# Altium project Timingcard_PROJECT.PrjPcb (part 3 of 4)

## Sheet 09-USBUart_PPSMUX_UARTMUX.SchDoc
size B; SheetNumber: 9; SheetTotal: 16; SPICEModelCacheLIOYUQKN: <root> / <DocumentId>LIOYUQKN</DocumentId> / <CacheFrame Number="0"> / <Model Name="emk105bj105_v-f" Kind="CKT"> / <Text>* EMK105BJ105_V-F     SPICE MODEL  ( General Type ) / *-------------------------------------------------------------------------------------------------------- / * Model Generated by TAIYO YUDEN Corporation (http://www.ty-top.com) / * Version 1.0 / * TAIYO YUDEN Control No. 170508_130520 / * Copyright(c) 2012 TAIYO YUDEN CO.,LTD. All Rights Reserved. / *-------------------------------------------------------------------------------------------------------- / * / * Products Name : Multilayer Ceramic Capacitors / * / * Characteristics : / *     Capacitance : 1 uF , Rated Voltage : 16V , TCC : X5R / *     Case Size : 1.0 x 0.5 / 0.039 x 0.02 [mm/inch] , Thickness : 0.5 / 0.02 [mm/inch] / *     (Conditions: Temperature = 25 degC , DC Bias Current/Voltage = 0A / 0V) / * / * Frequency Range : 40Hz - 3GHz / * / * External Node Assignments : / * / *  1  o---| |---o  2 / * / *-------------------------------------------------------------------------------------------------------- / .SubCkt EMK105BJ105_V-F 1 2 / **************************** / C0 1 110 0.68309u / Cm 1 101 0.26053u / C1 101 102 0.94076u / Rc1 101 102 1.9029k / C2 102 103 0.66707u / Rc2 102 103 120.36 / C3 103 110 0.57203u / Rc3 103 110 2.1097 / C2m 1 301 0.1871u / C21 301 302 3.2494u / Rc21 301 302 1.1117k / C22 302 303 2.1014u / Rc22 302 303 1.484k / C23 303 304 2.1172u / Rc23 303 304 1.3876k / C24 304 305 0.75729u / Rc24 304 305 332.59 / C25 305 306 0.94401u / Rc25 305 306 249.09 / C26 306 307 0.34674u / Rc26 306 307 28.352 / C27 307 308 0.37158u / Rc27 307 308 19.989 / C28 308 309 0.17933u / Rc28 308 309 31.748 / C29 309 110 0.016445u / Rc29 309 110 1.0592 / Rp0 1 110 100Meg / L0 110 120 0.2216n / Lm 120 130 0.1509n / L1 120 121 0.12659n / RL1 121 130 0.85161 / L2 120 122 0.15996n / RL2 122 130 0.42469 / L3 120 123 7.9543n / RL3 123 130 0.54643m / CR 120 124 0.24334u / LR 124 125 0.090738n / RR 125 130 68.076m / CL 130 140 2.7354p / LL 130 140 0.10762n / RL 130 140 50.614 / Rs 140 2 7.5416m / **************************** / .ends EMK105BJ105_V-F</Text> / </Model> / </CacheFrame> / </root>
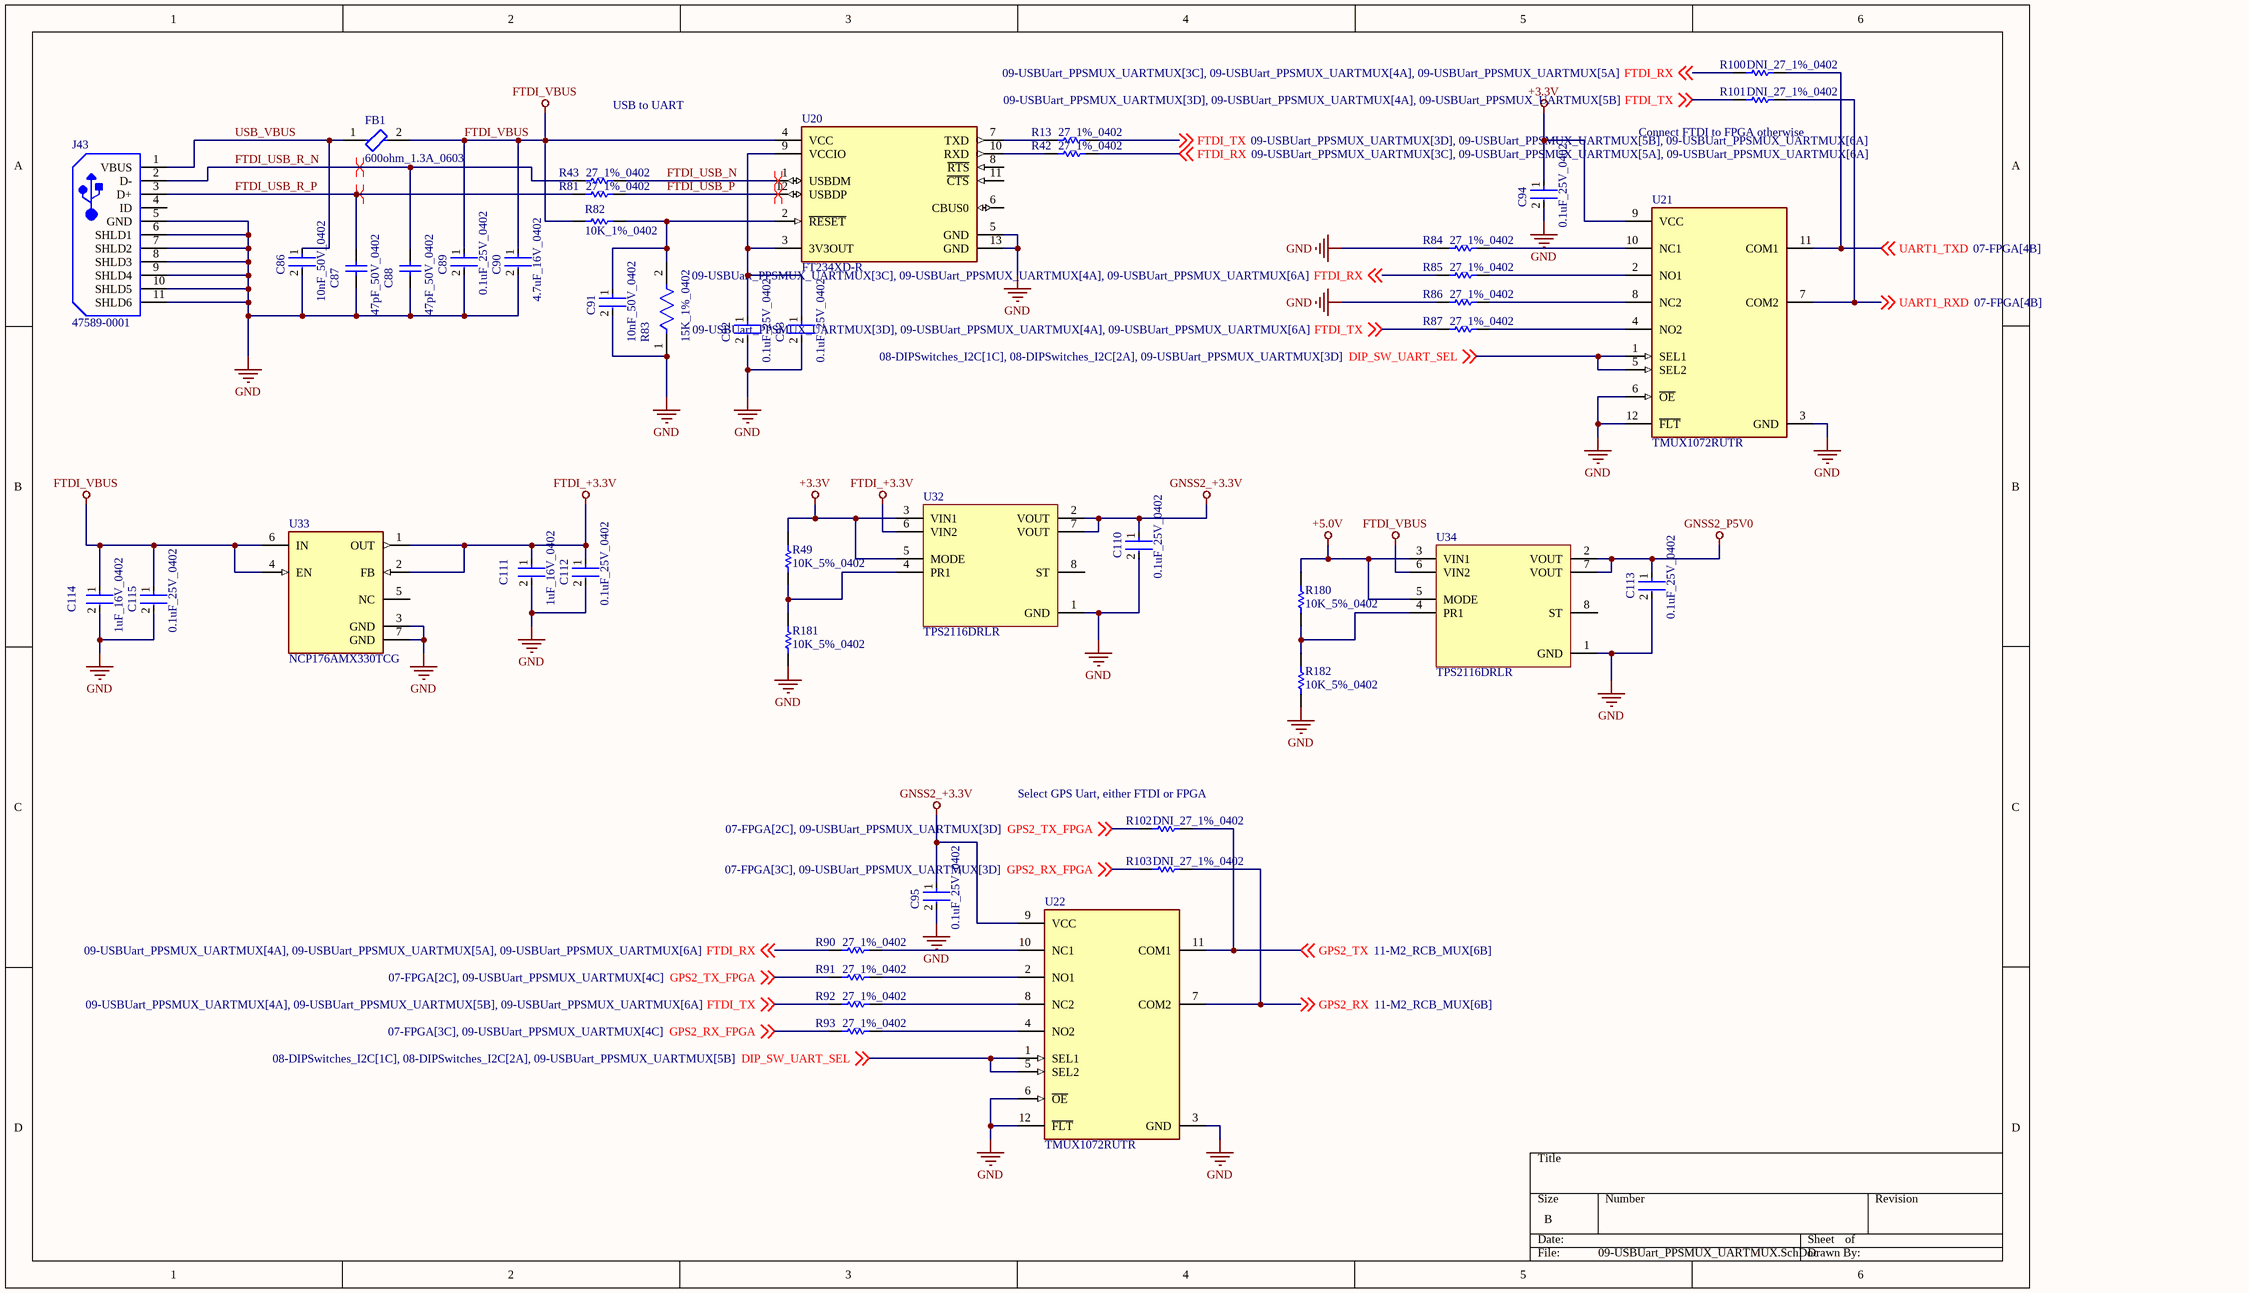
[diagram p9: 09-USBUart_PPSMUX_UARTMUX.SchDoc]

### Parts
C86  10nF_50V_0402  [FP-CC0402-MFG]
C87  47pF_50V_0402  [CAPC1005X55X25LL05T10]
C88  47pF_50V_0402  [CAPC1005X55X25LL05T10]
C89  0.1uF_25V_0402  [FP-0402-L_1_0_1-W_0_5_0_1-IPC_C]
C90  4.7uF_16V_0402  [FP-CL829-IPC_C]
C91  10nF_50V_0402  [FP-CC0402-MFG]
C92  0.1uF_25V_0402  [FP-0402-L_1_0_1-W_0_5_0_1-IPC_C]
C93  0.1uF_25V_0402  [FP-0402-L_1_0_1-W_0_5_0_1-IPC_C]
C94  0.1uF_25V_0402  [FP-0402-L_1_0_1-W_0_5_0_1-IPC_C]
C95  0.1uF_25V_0402  [FP-0402-L_1_0_1-W_0_5_0_1-IPC_C]
C110  0.1uF_25V_0402  [FP-0402-L_1_0_1-W_0_5_0_1-IPC_C]
C111  1uF_16V_0402  [FP-0402-L_1_0_0_05-W_0_5-IPC_A]
C112  0.1uF_25V_0402  [FP-0402-L_1_0_1-W_0_5_0_1-IPC_C]
C113  0.1uF_25V_0402  [FP-0402-L_1_0_1-W_0_5_0_1-IPC_C]
C114  1uF_16V_0402  [FP-0402-L_1_0_0_05-W_0_5-IPC_A]
C115  0.1uF_25V_0402  [FP-0402-L_1_0_1-W_0_5_0_1-IPC_C]
FB1  600ohm_1.3A_0603  [FP-BLM18-0_15-t0_8-IPC_A]
J43  47589-0001  [MOLX-47589-0001_V]
R13  27_1%_0402  [RESC1005X40X25NL05T05]
R42  27_1%_0402  [RESC1005X40X25NL05T05]
R43  27_1%_0402  [RESC1005X40X25NL05T05]
R49  10K_5%_0402  [RESC1005X40X25ML05T05]
R81  27_1%_0402  [RESC1005X40X25NL05T05]
R82  10K_1%_0402  [RESC1005X40X25LL05T10]
R83  15K_1%_0402  [FP-ERJ2R-MFG]
R84  27_1%_0402  [RESC1005X40X25NL05T05]
R85  27_1%_0402  [RESC1005X40X25NL05T05]
R86  27_1%_0402  [RESC1005X40X25NL05T05]
R87  27_1%_0402  [RESC1005X40X25NL05T05]
R90  27_1%_0402  [RESC1005X40X25NL05T05]
R91  27_1%_0402  [RESC1005X40X25NL05T05]
R92  27_1%_0402  [RESC1005X40X25NL05T05]
R93  27_1%_0402  [RESC1005X40X25NL05T05]
R100  DNI_27_1%_0402  [RESC1005X40X25NL05T05]  (no BOM)
R101  DNI_27_1%_0402  [RESC1005X40X25NL05T05]  (no BOM)
R102  DNI_27_1%_0402  [RESC1005X40X25NL05T05]  (no BOM)
R103  DNI_27_1%_0402  [RESC1005X40X25NL05T05]  (no BOM)
R180  10K_5%_0402  [RESC1005X40X25ML05T05]
R181  10K_5%_0402  [RESC1005X40X25ML05T05]
R182  10K_5%_0402  [RESC1005X40X25ML05T05]
U20  FT234XD-R  [FP-DFN-12-IPC_B]
U21  TMUX1072RUTR  [FP-RUT0012A-MFG]
U22  TMUX1072RUTR  [FP-RUT0012A-MFG]
U32  TPS2116DRLR  [IC_TPS2116]
U33  NCP176AMX330TCG  [FP-711AT-MFG]
U34  TPS2116DRLR  [IC_TPS2116]

### Nets
+3.3V: C94.1 R49.2 U21.9(VCC) U32.3(VIN1) U32.5(MODE)
+5.0V: R180.2 U34.3(VIN1) U34.5(MODE)
FTDI_+3.3V: C111.1 C112.1 U32.6(VIN2) U33.1(OUT) U33.2(FB)
FTDI_VBUS: C89.1 C90.1 C114.1 C115.1 FB1.2 R82.2 U20.4(VCC) U33.4(EN) U33.6(IN) U34.6(VIN2)
GND: C86.2 C87.1 C88.1 C89.2 C90.2 C91.2 C92.2 C93.2 C94.2 C95.2 C110.2 C111.2 C112.2 C113.2 C114.2 C115.2 J43.5(GND) J43.6(SHLD1) J43.7(SHLD2) J43.8(SHLD3) J43.9(SHLD4) J43.10(SHLD5) J43.11(SHLD6) R83.1 R84.1 R86.1 R181.1 R182.1 U20.5(GND) U20.13(GND) U21.3(GND) U21.6(~{OE}) U21.12(~{FLT}) U22.3(GND) U22.6(~{OE}) U22.12(~{FLT}) U32.1(GND) U33.3(GND) U33.7(GND) U34.1(GND)
GNSS2_+3.3V: C95.1 C110.1 U22.9(VCC) U32.2(VOUT) U32.7(VOUT)
GNSS2_P5V0: C113.1 U34.2(VOUT) U34.7(VOUT)
DIP_SW_UART_SEL: U21.1(SEL1) U21.5(SEL2) U22.1(SEL1) U22.5(SEL2) ; off-sheet DIP_SW_UART_SEL
FTDI_RX: R42.2 R85.1 R90.1 R100.1 ; off-sheet FTDI_RX
FTDI_TX: R13.2 R87.1 R92.1 R101.1 ; off-sheet FTDI_TX
FTDI_USB_N: R43.2 U20.1(USBDM)
FTDI_USB_P: R81.2 U20.12(USBDP)
FTDI_USB_R_N: C88.2 J43.2(D-) R43.1
FTDI_USB_R_P: C87.2 J43.3(D+) R81.1
GPS2_RX: R103.2 U22.7(COM2) ; off-sheet GPS2_RX
GPS2_RX_FPGA: R93.1 R103.1 ; off-sheet GPS2_RX_FPGA
GPS2_TX: R102.2 U22.11(COM1) ; off-sheet GPS2_TX
GPS2_TX_FPGA: R91.1 R102.1 ; off-sheet GPS2_TX_FPGA
UART1_RXD: R101.2 U21.7(COM2) ; off-sheet UART1_RXD
UART1_TXD: R100.2 U21.11(COM1) ; off-sheet UART1_TXD
USB_VBUS: C86.1 FB1.1 J43.1(VBUS)
NetC91_1: C91.1 R82.1 R83.2 U20.2(~{RESET})
NetC92_1: C92.1 C93.1 U20.3(3V3OUT) U20.9(VCCIO)
NetR13_1: R13.1 U20.7(TXD)
NetR42_1: R42.1 U20.10(RXD)
NetR49_1: R49.1 R181.2 U32.4(PR1)
NetR84_2: R84.2 U21.10(NC1)
NetR85_2: R85.2 U21.2(NO1)
NetR86_2: R86.2 U21.8(NC2)
NetR87_2: R87.2 U21.4(NO2)
NetR90_2: R90.2 U22.10(NC1)
NetR91_2: R91.2 U22.2(NO1)
NetR92_2: R92.2 U22.8(NC2)
NetR93_2: R93.2 U22.4(NO2)
NetR180_1: R180.1 R182.2 U34.4(PR1)

Not connected (* = marked no-connect by the designer): J43 4(ID); U20 6(CBUS0) 8(~{RTS}) 11(~{CTS}); U32 8(ST); U33 5(NC); U34 8(ST)

### Layout directives
differential pair: FTDI_USB_N, FTDI_USB_P, FTDI_USB_R_N, FTDI_USB_R_P

### Notes on the sheet
- USB to UART
- (near R101) Connect FTDI to FPGA otherwise
- (near R102) Select GPS Uart, either FTDI or FPGA

### Library data of the parts
C86 C91 = CMP-2100-03592-2: CAP CER 10000PF 50V X7R 0402; Manufacturer Part Number: CC0402KRX7R9BB103; Manufacturer: YAGEO; Temperature Coefficient: 30ppm/°C; Capacitance: 10 nF; Material: Ceramic; Automotive Grade: NA; Tolerance: 0.1; Value: 10 nF; Device Class L3: Ceramic Capacitors; Temperature: -55°C to +125°C; Footprint Url: http://www.yageo.com/exep/pages/download/literatures/UPY-C_GEN_24.pdf; Ipc Land Pattern Name: CAPC10050X50; Device Class L1: Passive Components; Automotive: No; Octopart: https://octopart.com/cc0402krx7r9bb103-yageo-8376513; Lead Free: Yes; Temperature Range Low: -55°C; Height: 0.55mm; ComponentLink2URL: http://www.yageo.com/documents/recent/UPY-GP_NP0_16V-to-50V_16.pdf; Category: Cap; ComponentLink2Description: Datasheet; Temperature Range High: +125°C; Digikey Description: CAP CER 10000PF 50V X7R 0402; Voltage Rating: 50 V; Package: CC0402; Device Class L2: Capacitors; Mouser Description: 0402 10 nF 50 V ±10 % Tolerance X7R SMT Multilayer Ceramic Capacitor; RoHS: TRUE; Temperature Characteristic: X7R
C87 C88 = CMP-2008-04368-1: Part Number: GRM1555C1H470JA01D; Manufacturer: Murata
C89 C92-C95 C110 C112 C113 C115 = CMP-2008-02519-2: General Purpose Ceramic Capacitor, 0402, 100nF, 10%, X7R, 15%, 25V; Package Quantity: 1; Capacitance: 100nF; Min Operating Temperature: -55°C; Voltage: 25V; Voltage Rating: 25V; Construction: Flat; Max Operating Temperature: 125°C; Radiation Hardening: No; Depth: 0.5mm; Thickness: 0.022inch; Voltage Rating (DC): 25V; Number of Pins: 2; Lead Free: Lead Free; Series: -; REACH SVHC: No SVHC; Length: 1mm; Dielectric: X7R; RoHS Compliant: Yes; Mount: Surface Mount; Packaging: Tape and Reel; Case/Package: 0402; Case Code (Imperial): 0402; Termination: SMD/SMT; Width: 0.02inch; Case Code (Metric): 1005; Tolerance: 10%
C90 = CMP-13271-001468-1: Cap Ceramic 4.7uF 16V X5R ±20% SMD 0402 +85°C Paper T/R; Mount: Surface Mount; Case Code (Metric): 1005; Case/Package: 0402; Length: 0.039inch; Capacitance: 4.7uF; Voltage Rating: 16V; Max Operating Temperature: 85°C; Tolerance: 20%; Thickness: 0.022inch; Min Operating Temperature: -55°C; Case Code (Imperial): 0402; Packaging: Tape and Reel; Width: 0.02inch
C111 C114 = CMP-14477-000104-2: None; Tolerance: 10%; Voltage Rating: 16V; Dielectric: X5R; Capacitance: 1uF; Packaging: Tape and Reel; Depth: 0.5mm; Mount: Surface Mount; Thickness: 0.022inch; Package Quantity: 1; Min Operating Temperature: -55°C; Series: M; Voltage Rating (DC): 16V; Termination: SMD/SMT; Case/Package: 0402; Number of Pins: 2; Case Code (Imperial): 0402; Length: 1mm; Halogen Free: Halogen Free; Case Code (Metric): 1005; Width: 0.02inch; RoHS Compliant: Yes; Radiation Hardening: No; Max Operating Temperature: 85°C; Height: 0.5mm; Construction: Flat
FB1 = CMP-0686-00581-3: Chip Ferrite Bead, 0603, 600Ω @ 100MHz, 0.15Ω, 25%, 1.3A; Material: Steel; Number of Lines: 1; Impedance: 600R; DC Resistance (DCR): 150mR; Tolerance: 25%; Case Code (Metric): 1608; Width: 0.8mm; DC Current: 1.3A; Max DC Current: 1.3A; Package Quantity: 1; Number of Pins: 2; Military Standard: Not; RoHS Compliant: Yes; Termination: SMD/SMT; Max Operating Temperature: 125°C; Length: 1.6mm; Depth: 0.8mm; Case Code (Imperial): 0603; Series: BLM18K; Inductor Type: FERRITE BEAD; Core Material: Ferrite; Number of Circuits: 1; Height: 0.8mm; Case/Package: 0603; REACH SVHC: No SVHC; Packaging: Tape and Reel; Min Operating Temperature: -55°C; Max Current Rating: 1.3A; Radiation Hardening: No; Current Rating: 1.3A; Lead Free: Lead Free; Test Frequency: 100MHz; Weight: 7.1E-05oz
J43 = CMP-2000-05610-1: Right Angle Female Type AB Micro USB Connector, 30 V, 1.8 A, -30 to 85 degC, RoHS, Tape and Reel; Number of Ports: 1Port; Current Rating: 1.8A; Brand: Molex; Connector Type: MicroUSBTypeABreceptacle; Number of Contacts: 5Contact; Voltage Rating: 30VAC; Color: Black; Product: MicroUSBTypeABConnectors; Package URL: http://www.molex.com/pdm_docs/sd/475890001_sd.pdf; Contact Plating: Gold; Datasheet URL: http://www.molex.com/webdocs/datasheets/pdf/en-us/0475890001_IO_CONNECTORS.pdf; Operating Temperature Range: -20Cto+85C; Termination Style: SMD/SMT; Mounting Angle: Right; Package Reference: 47589-0001; Gender: Female; Package Description: Micro USB Connector, Pitch 0.65 mm, 5 Positions, Body 7.5 x 5.6 mm; Mounting Technology: SurfaceMount; Contact Material: CopperAlloy; Packaging: Reel; RoHS: True; Standard: USB; Manufacturer URL: http://www.molex.com/; Manufacturer: Molex; Datasheet Version: 12/2016; Product Category: USBConnectors; Series: 47589
R13 R42 R43 R81 R84-R87 R90-R93 R100-R103 = CMP-2002-08434-1: Part Number: CRCW040227R0FKED; Manufacturer: Vishay Dale
R49 R180-R182 = CMP-2002-00433-1: Part Number: ERJ-2GEJ103X; Manufacturer: Panasonic
R82 = CMP-2002-07353-1: Part Number: RC0402FR-0710KL; Manufacturer: Yageo / Phycomp
R83 = CMP-2002-00694-4: RES SMD 15K OHM 1% 1/10W 0402; Manufacturer Part Number: ERJ-2RKF1502X; Manufacturer: Panasonic; Automotive Grade: Grade 0; Voltage Rating: 50V; Resistance: 15kΩ; Temperature Coefficient: 100ppm/°C; Power Rating: 0.1W; Value: 15kΩ; ComponentLink2URL: https://industrial.panasonic.com/cdbs/www-data/pdf/RDA0000/AOA0000C304.pdf; Automotive: Yes; Temperature: -55°C to +155°C; Height: 0.4mm; Digikey Description: RES SMD 15K OHM 1% 1/10W 0402; Category: Res; Device Class L2: Resistors; Device Class L1: Passive Components; Package: ERJ2R; Temperature Range Low: -55°C; Tolerance: 1%; Series: ERJ; Footprint Url: https://b2b-api.panasonic.eu/file_stream/pids/fileversion/1180; Mouser Description: Res Thick Film 1.0 x 0.5 mm 15K Ohm 1% 0.1W(1/10W) 100ppm/ C Molded SMD Punched Carrier T/R; Composition: Thick Film; Lead Free: Yes; Device Class L3: Chip SMD Resistors; Octopart: https://octopart.com/erj-2rkf1502x-panasonic-55404985; RoHS: TRUE; Temperature Range High: +155°C; ComponentLink2Description: Datasheet
U20 = CMP-0248-00027-3: IC USB SERIAL BASIC UART 12DFN; Min Supply Voltage: 2.97V; Number of Ports: 1; Operating Supply Voltage: 5V; Operating Supply Current: 8mA; Max Supply Voltage: 5.5V; Data Rate: 3Mbps; Length: 3mm; Case/Package: DFN; Mount: Surface Mount; Packaging: Tape and Reel; Max Operating Temperature: 85°C; Height: 0.75mm; Number of Pins: 12; Number of Transceivers: 1; Package Quantity: 5000; Min Operating Temperature: -40°C; Width: 3mm; REACH SVHC: No SVHC; Interface: UART; Lead Free: Lead Free
U21 U22 = CMP-04892-000114-1: IC SWITCH SPDT DUAL 12UQFN; Number of Circuits: 2; -3db Bandwidth: 1.2GHz; On-State Resistance: 18R; Number of Pins: 12; Min Operating Temperature: -40°C; RoHS Compliant: Yes; Max Operating Temperature: 125°C; Number of Channels: 2; Packaging: Tape and Reel
U32 U34 = IC_TPS2116DRLR: 1.6-V to 5.5-V, 40-mΩ, 2.5-A, low-IQ, priority power multiplexer 8-SOT-5X3 -40 to 125; MF: Texas Instruments; Check_prices: https://www.snapeda.com/parts/TPS2116DRLR/Texas%20Instruments/view-part/5674360/?ref=eda; MP: TPS2116DRLR; Package: Package; Price: None; Availability: No availability data; SnapEDA_Link: https://www.snapeda.com/parts/TPS2116DRLR/Texas%20Instruments/view-part/5674360/?ref=snap; Value: *; Supplier 1: LCSC; Manufacturer: Texas Instruments; Manufacturer Part Number: TPS2116DRLR; RoHS: Yes; Category: Voltage Supervisors; Stock 1: 562; Pricing 1: 1=0.6651, 10=0.5457, 30=0.4853, 100=0.4264, 500=0.3914, 1000=0.3723 (USD); Supplier Part Number 1: C3235557
U33 = CMP-07128-000022-1: IC REG LINEAR 3.3V 500MA 6XDFN; Manufacturer: ON Semiconductor; Output Type: Fixed; Dropout Voltage: 295mV; Number Of Outputs: 1; Standoff Height: 0mm; Min Supply Voltage: 1.4V; Nominal Supply Current: 60uA; Max Supply Voltage: 5.5V; Max Junction Temp: +150°C; Accuracy Percentage: 0.8%; Footprint Url: https://www.onsemi.com/pub/Collateral/711AT.PDF; Device Class L2: Power Management ICs; Device Class L1: Integrated Circuits (ICs); Digikey Description: IC REG LINEAR 3.3V 500MA 6XDFN; ComponentLink2Description: Datasheet; Output Voltage: 3.3V; ComponentLink2URL: https://www.onsemi.com/pub/Collateral/NCP176-D.PDF; RoHS: TRUE; Lead Free: Yes; Output Current: 500mA; Automotive: No; Temperature Range High: +150°C; Height: 0.45mm; Package: 711AT; Device Class L3: Voltage Regulators - Linear; Octopart: https://octopart.com/ncp176amx330tcg-on+semiconductor-61522616; Category: IC; Manufacturer Part Number: NCP176AMX330TCG; Ipc Land Pattern Name: DFN120X120X37-6; Temperature: to +150°C

## Sheet 11-M2_RCB_MUX.SchDoc
size B; SheetNumber: 11; SheetTotal: 16
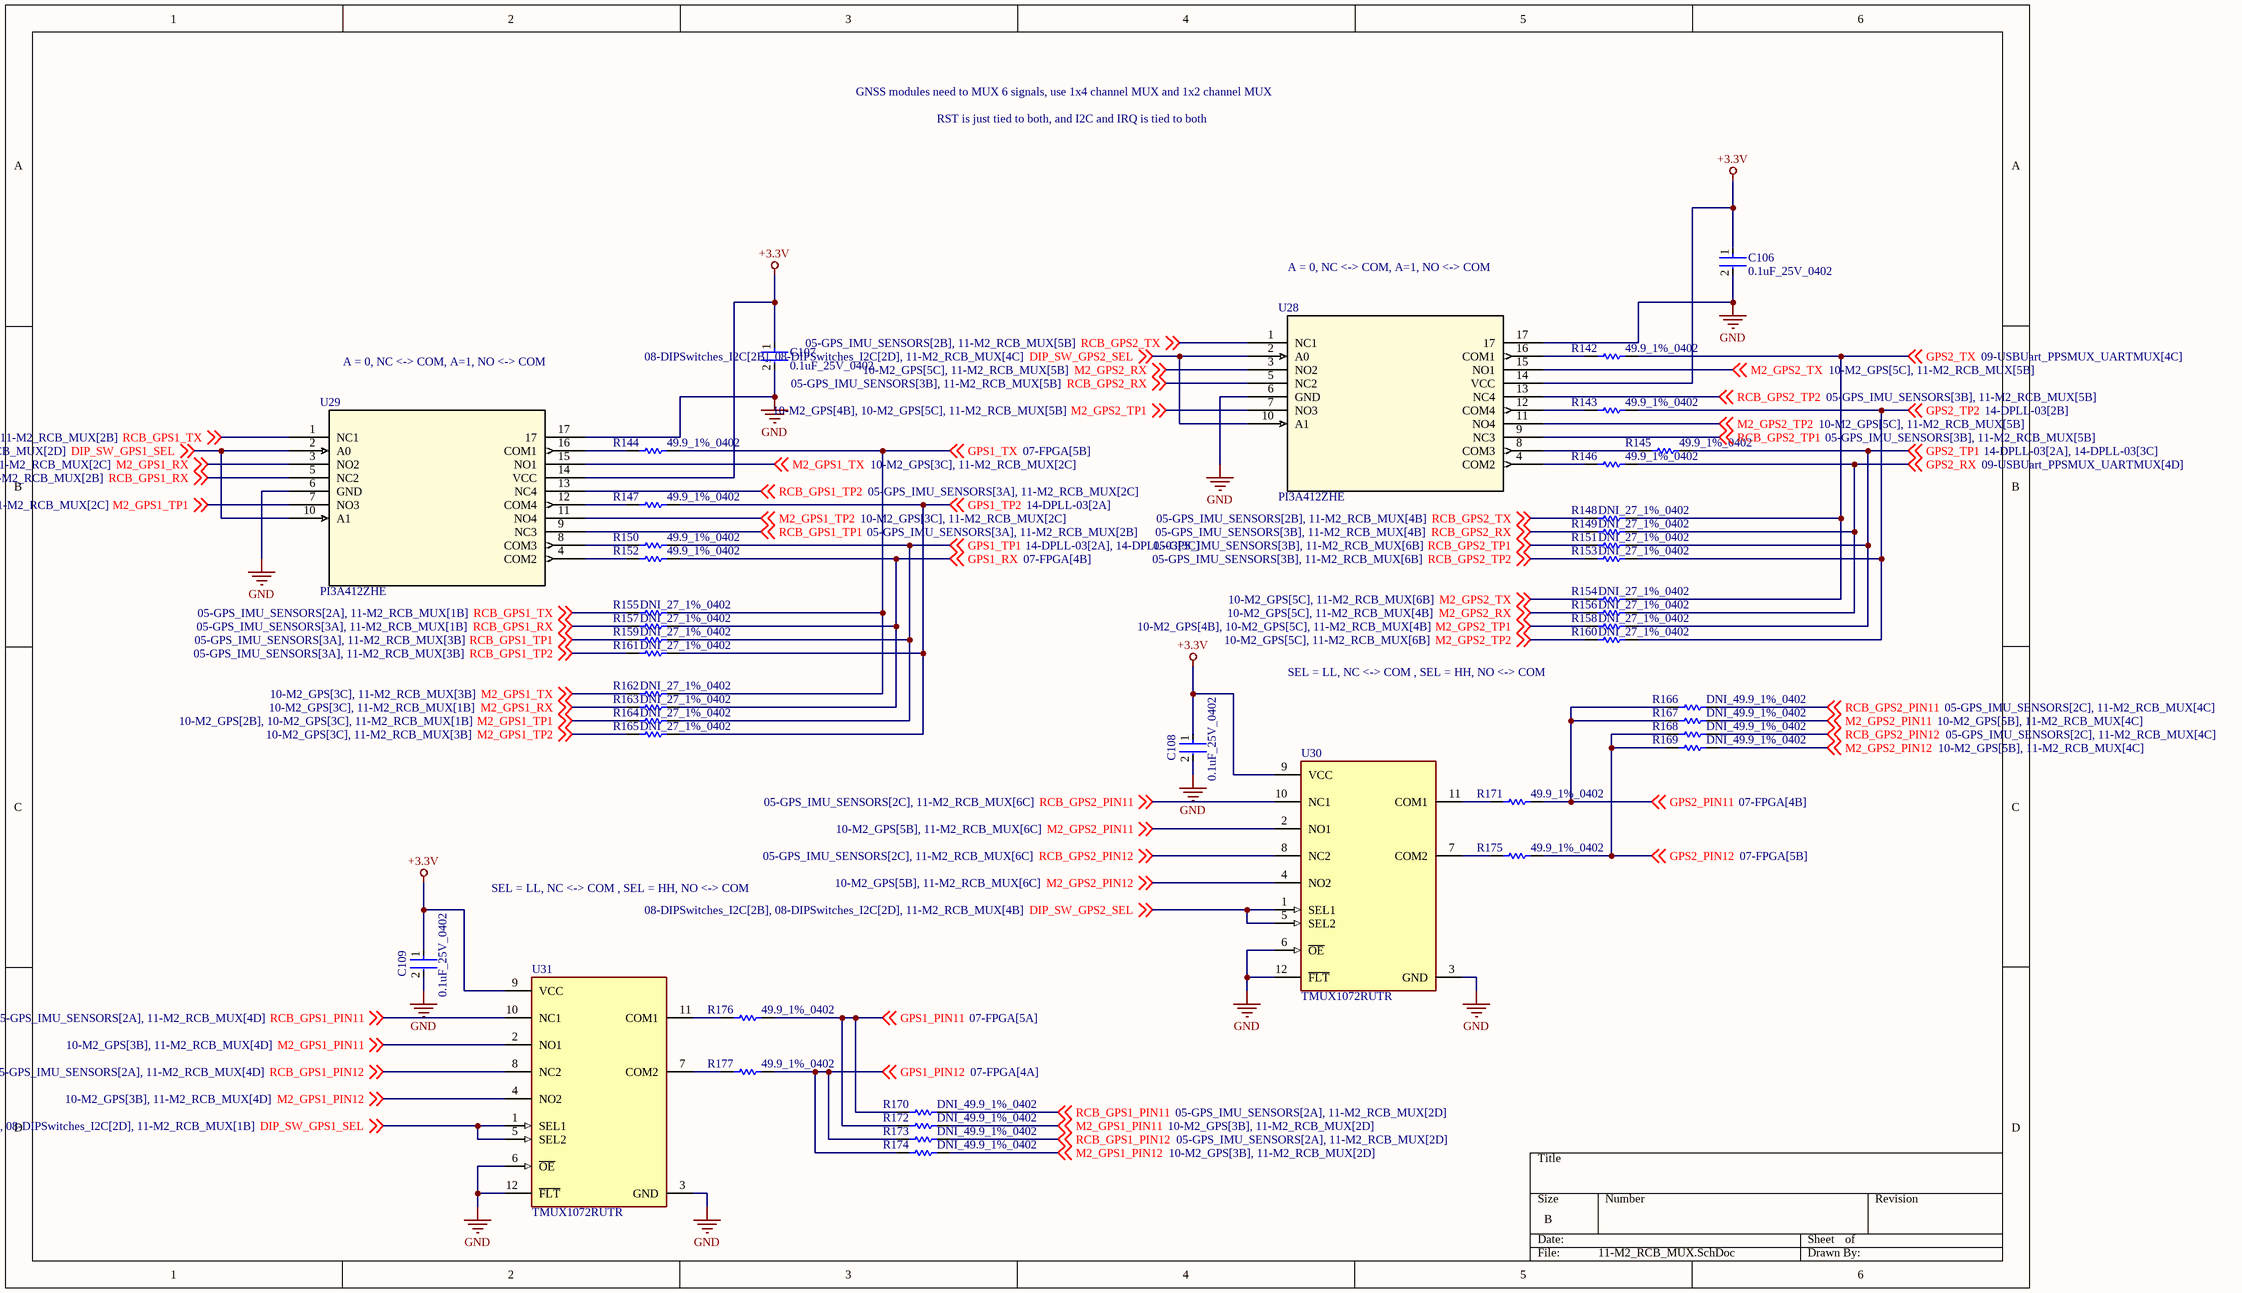
[diagram p10: 11-M2_RCB_MUX.SchDoc]

### Parts
C106  0.1uF_25V_0402  [FP-0402-L_1_0_1-W_0_5_0_1-IPC_C]
C107  0.1uF_25V_0402  [FP-0402-L_1_0_1-W_0_5_0_1-IPC_C]
C108  0.1uF_25V_0402  [FP-0402-L_1_0_1-W_0_5_0_1-IPC_C]
C109  0.1uF_25V_0402  [FP-0402-L_1_0_1-W_0_5_0_1-IPC_C]
R142  49.9_1%_0402  [RESC1005X40X25LL05T10]
R143  49.9_1%_0402  [RESC1005X40X25LL05T10]
R144  49.9_1%_0402  [RESC1005X40X25LL05T10]
R145  49.9_1%_0402  [RESC1005X40X25LL05T10]
R146  49.9_1%_0402  [RESC1005X40X25LL05T10]
R147  49.9_1%_0402  [RESC1005X40X25LL05T10]
R148  DNI_27_1%_0402  [RESC1005X40X25NL05T05]  (no BOM)
R149  DNI_27_1%_0402  [RESC1005X40X25NL05T05]  (no BOM)
R150  49.9_1%_0402  [RESC1005X40X25LL05T10]
R151  DNI_27_1%_0402  [RESC1005X40X25NL05T05]  (no BOM)
R152  49.9_1%_0402  [RESC1005X40X25LL05T10]
R153  DNI_27_1%_0402  [RESC1005X40X25NL05T05]  (no BOM)
R154  DNI_27_1%_0402  [RESC1005X40X25NL05T05]  (no BOM)
R155  DNI_27_1%_0402  [RESC1005X40X25NL05T05]  (no BOM)
R156  DNI_27_1%_0402  [RESC1005X40X25NL05T05]  (no BOM)
R157  DNI_27_1%_0402  [RESC1005X40X25NL05T05]  (no BOM)
R158  DNI_27_1%_0402  [RESC1005X40X25NL05T05]  (no BOM)
R159  DNI_27_1%_0402  [RESC1005X40X25NL05T05]  (no BOM)
R160  DNI_27_1%_0402  [RESC1005X40X25NL05T05]  (no BOM)
R161  DNI_27_1%_0402  [RESC1005X40X25NL05T05]  (no BOM)
R162  DNI_27_1%_0402  [RESC1005X40X25NL05T05]  (no BOM)
R163  DNI_27_1%_0402  [RESC1005X40X25NL05T05]  (no BOM)
R164  DNI_27_1%_0402  [RESC1005X40X25NL05T05]  (no BOM)
R165  DNI_27_1%_0402  [RESC1005X40X25NL05T05]  (no BOM)
R166  DNI_49.9_1%_0402  [RESC1005X40X25LL05T10]  (no BOM)
R167  DNI_49.9_1%_0402  [RESC1005X40X25LL05T10]  (no BOM)
R168  DNI_49.9_1%_0402  [RESC1005X40X25LL05T10]  (no BOM)
R169  DNI_49.9_1%_0402  [RESC1005X40X25LL05T10]  (no BOM)
R170  DNI_49.9_1%_0402  [RESC1005X40X25LL05T10]  (no BOM)
R171  49.9_1%_0402  [RESC1005X40X25LL05T10]
R172  DNI_49.9_1%_0402  [RESC1005X40X25LL05T10]  (no BOM)
R173  DNI_49.9_1%_0402  [RESC1005X40X25LL05T10]  (no BOM)
R174  DNI_49.9_1%_0402  [RESC1005X40X25LL05T10]  (no BOM)
R175  49.9_1%_0402  [RESC1005X40X25LL05T10]
R176  49.9_1%_0402  [RESC1005X40X25LL05T10]
R177  49.9_1%_0402  [RESC1005X40X25LL05T10]
U28  PI3A412ZHE  [ZH16_PER]
U29  PI3A412ZHE  [ZH16_PER]
U30  TMUX1072RUTR  [FP-RUT0012A-MFG]
U31  TMUX1072RUTR  [FP-RUT0012A-MFG]

### Nets
+3.3V: C106.1 C107.1 C108.1 C109.1 U28.14(VCC) U29.14(VCC) U30.9(VCC) U31.9(VCC)
GND: C106.2 C107.2 C108.2 C109.2 U28.6(GND) U28.17 U29.6(GND) U29.17 U30.3(GND) U30.6(~{OE}) U30.12(~{FLT}) U31.3(GND) U31.6(~{OE}) U31.12(~{FLT})
DIP_SW_GPS1_SEL: U29.2(A0) U29.10(A1) U31.1(SEL1) U31.5(SEL2) ; off-sheet DIP_SW_GPS1_SEL
DIP_SW_GPS2_SEL: U28.2(A0) U28.10(A1) U30.1(SEL1) U30.5(SEL2) ; off-sheet DIP_SW_GPS2_SEL
GPS1_PIN11: R170.1 R172.1 R176.2 ; off-sheet GPS1_PIN11
GPS1_PIN12: R173.1 R174.1 R177.2 ; off-sheet GPS1_PIN12
GPS1_RX: R152.2 R157.2 R163.2 ; off-sheet GPS1_RX
GPS1_TP1: R150.2 R159.2 R164.2 ; off-sheet GPS1_TP1
GPS1_TP2: R147.2 R161.2 R165.2 ; off-sheet GPS1_TP2
GPS1_TX: R144.2 R155.2 R162.2 ; off-sheet GPS1_TX
GPS2_PIN11: R166.1 R167.1 R171.2 ; off-sheet GPS2_PIN11
GPS2_PIN12: R168.1 R169.1 R175.2 ; off-sheet GPS2_PIN12
GPS2_RX: R146.2 R149.2 R156.2 ; off-sheet GPS2_RX
GPS2_TP1: R145.2 R151.2 R158.2 ; off-sheet GPS2_TP1
GPS2_TP2: R143.2 R153.2 R160.2 ; off-sheet GPS2_TP2
GPS2_TX: R142.2 R148.2 R154.2 ; off-sheet GPS2_TX
M2_GPS1_PIN11: R172.2 U31.2(NO1) ; off-sheet M2_GPS1_PIN11
M2_GPS1_PIN12: R174.2 U31.4(NO2) ; off-sheet M2_GPS1_PIN12
M2_GPS1_RX: R163.1 U29.3(NO2) ; off-sheet M2_GPS1_RX
M2_GPS1_TP1: R164.1 U29.7(NO3) ; off-sheet M2_GPS1_TP1
M2_GPS1_TP2: R165.1 U29.11(NO4) ; off-sheet M2_GPS1_TP2
M2_GPS1_TX: R162.1 U29.15(NO1) ; off-sheet M2_GPS1_TX
M2_GPS2_PIN11: R167.2 U30.2(NO1) ; off-sheet M2_GPS2_PIN11
M2_GPS2_PIN12: R169.2 U30.4(NO2) ; off-sheet M2_GPS2_PIN12
M2_GPS2_RX: R156.1 U28.3(NO2) ; off-sheet M2_GPS2_RX
M2_GPS2_TP1: R158.1 U28.7(NO3) ; off-sheet M2_GPS2_TP1
M2_GPS2_TP2: R160.1 U28.11(NO4) ; off-sheet M2_GPS2_TP2
M2_GPS2_TX: R154.1 U28.15(NO1) ; off-sheet M2_GPS2_TX
RCB_GPS1_PIN11: R170.2 U31.10(NC1) ; off-sheet RCB_GPS1_PIN11
RCB_GPS1_PIN12: R173.2 U31.8(NC2) ; off-sheet RCB_GPS1_PIN12
RCB_GPS1_RX: R157.1 U29.5(NC2) ; off-sheet RCB_GPS1_RX
RCB_GPS1_TP1: R159.1 U29.9(NC3) ; off-sheet RCB_GPS1_TP1
RCB_GPS1_TP2: R161.1 U29.13(NC4) ; off-sheet RCB_GPS1_TP2
RCB_GPS1_TX: R155.1 U29.1(NC1) ; off-sheet RCB_GPS1_TX
RCB_GPS2_PIN11: R166.2 U30.10(NC1) ; off-sheet RCB_GPS2_PIN11
RCB_GPS2_PIN12: R168.2 U30.8(NC2) ; off-sheet RCB_GPS2_PIN12
RCB_GPS2_RX: R149.1 U28.5(NC2) ; off-sheet RCB_GPS2_RX
RCB_GPS2_TP1: R151.1 U28.9(NC3) ; off-sheet RCB_GPS2_TP1
RCB_GPS2_TP2: R153.1 U28.13(NC4) ; off-sheet RCB_GPS2_TP2
RCB_GPS2_TX: R148.1 U28.1(NC1) ; off-sheet RCB_GPS2_TX
NetR142_1: R142.1 U28.16(COM1)
NetR143_1: R143.1 U28.12(COM4)
NetR144_1: R144.1 U29.16(COM1)
NetR145_1: R145.1 U28.8(COM3)
NetR146_1: R146.1 U28.4(COM2)
NetR147_1: R147.1 U29.12(COM4)
NetR150_1: R150.1 U29.8(COM3)
NetR152_1: R152.1 U29.4(COM2)
NetR171_1: R171.1 U30.11(COM1)
NetR175_1: R175.1 U30.7(COM2)
NetR176_1: R176.1 U31.11(COM1)
NetR177_1: R177.1 U31.7(COM2)

### Notes on the sheet
- GNSS modules need to MUX 6 signals, use 1x4 channel MUX and 1x2 channel MUX
- RST is just tied to both, and I2C and IRQ is tied to both
- A = 0, NC <-> COM, A=1, NO <-> COM
- SEL = LL, NC <-> COM , SEL = HH, NO <-> COM

### Library data of the parts
C106-C109 = CMP-2008-02519-2: as C89 on sheet 09-USBUart_PPSMUX_UARTMUX; Package Quantity: 1; Capacitance: 100nF; Min Operating Temperature: -55°C; Voltage: 25V; Voltage Rating: 25V; Construction: Flat; Max Operating Temperature: 125°C; Radiation Hardening: No; Depth: 0.5mm; Thickness: 0.022inch; Voltage Rating (DC): 25V; Number of Pins: 2; Lead Free: Lead Free; Series: -; REACH SVHC: No SVHC; Length: 1mm; Dielectric: X7R; RoHS Compliant: Yes; Mount: Surface Mount; Packaging: Tape and Reel; Case/Package: 0402; Case Code (Imperial): 0402; Termination: SMD/SMT; Width: 0.02inch; Case Code (Metric): 1005; Tolerance: 10%
R142-R147 R150 R152 R166-R177 = CMP-2002-07709-1: Manufacturer: Yageo / Phycomp; Part Number: RC0402FR-0749R9L
R148 R149 R151 R153-R165 = CMP-2002-08434-1: as R13 on sheet 09-USBUart_PPSMUX_UARTMUX
U28 U29 = PI3A412ZHE: No Description Available; Mfr_Name: Pericom; RefDes: RefDes; Type: Type
U30 U31 = CMP-04892-000114-1: as U21 on sheet 09-USBUart_PPSMUX_UARTMUX; Number of Pins: 12; Min Operating Temperature: -40°C; RoHS Compliant: Yes; Max Operating Temperature: 125°C; Number of Channels: 2; Packaging: Tape and Reel

## Sheet 12-DPLL-01.SchDoc
size B; SheetNumber: 12; SheetTotal: 16
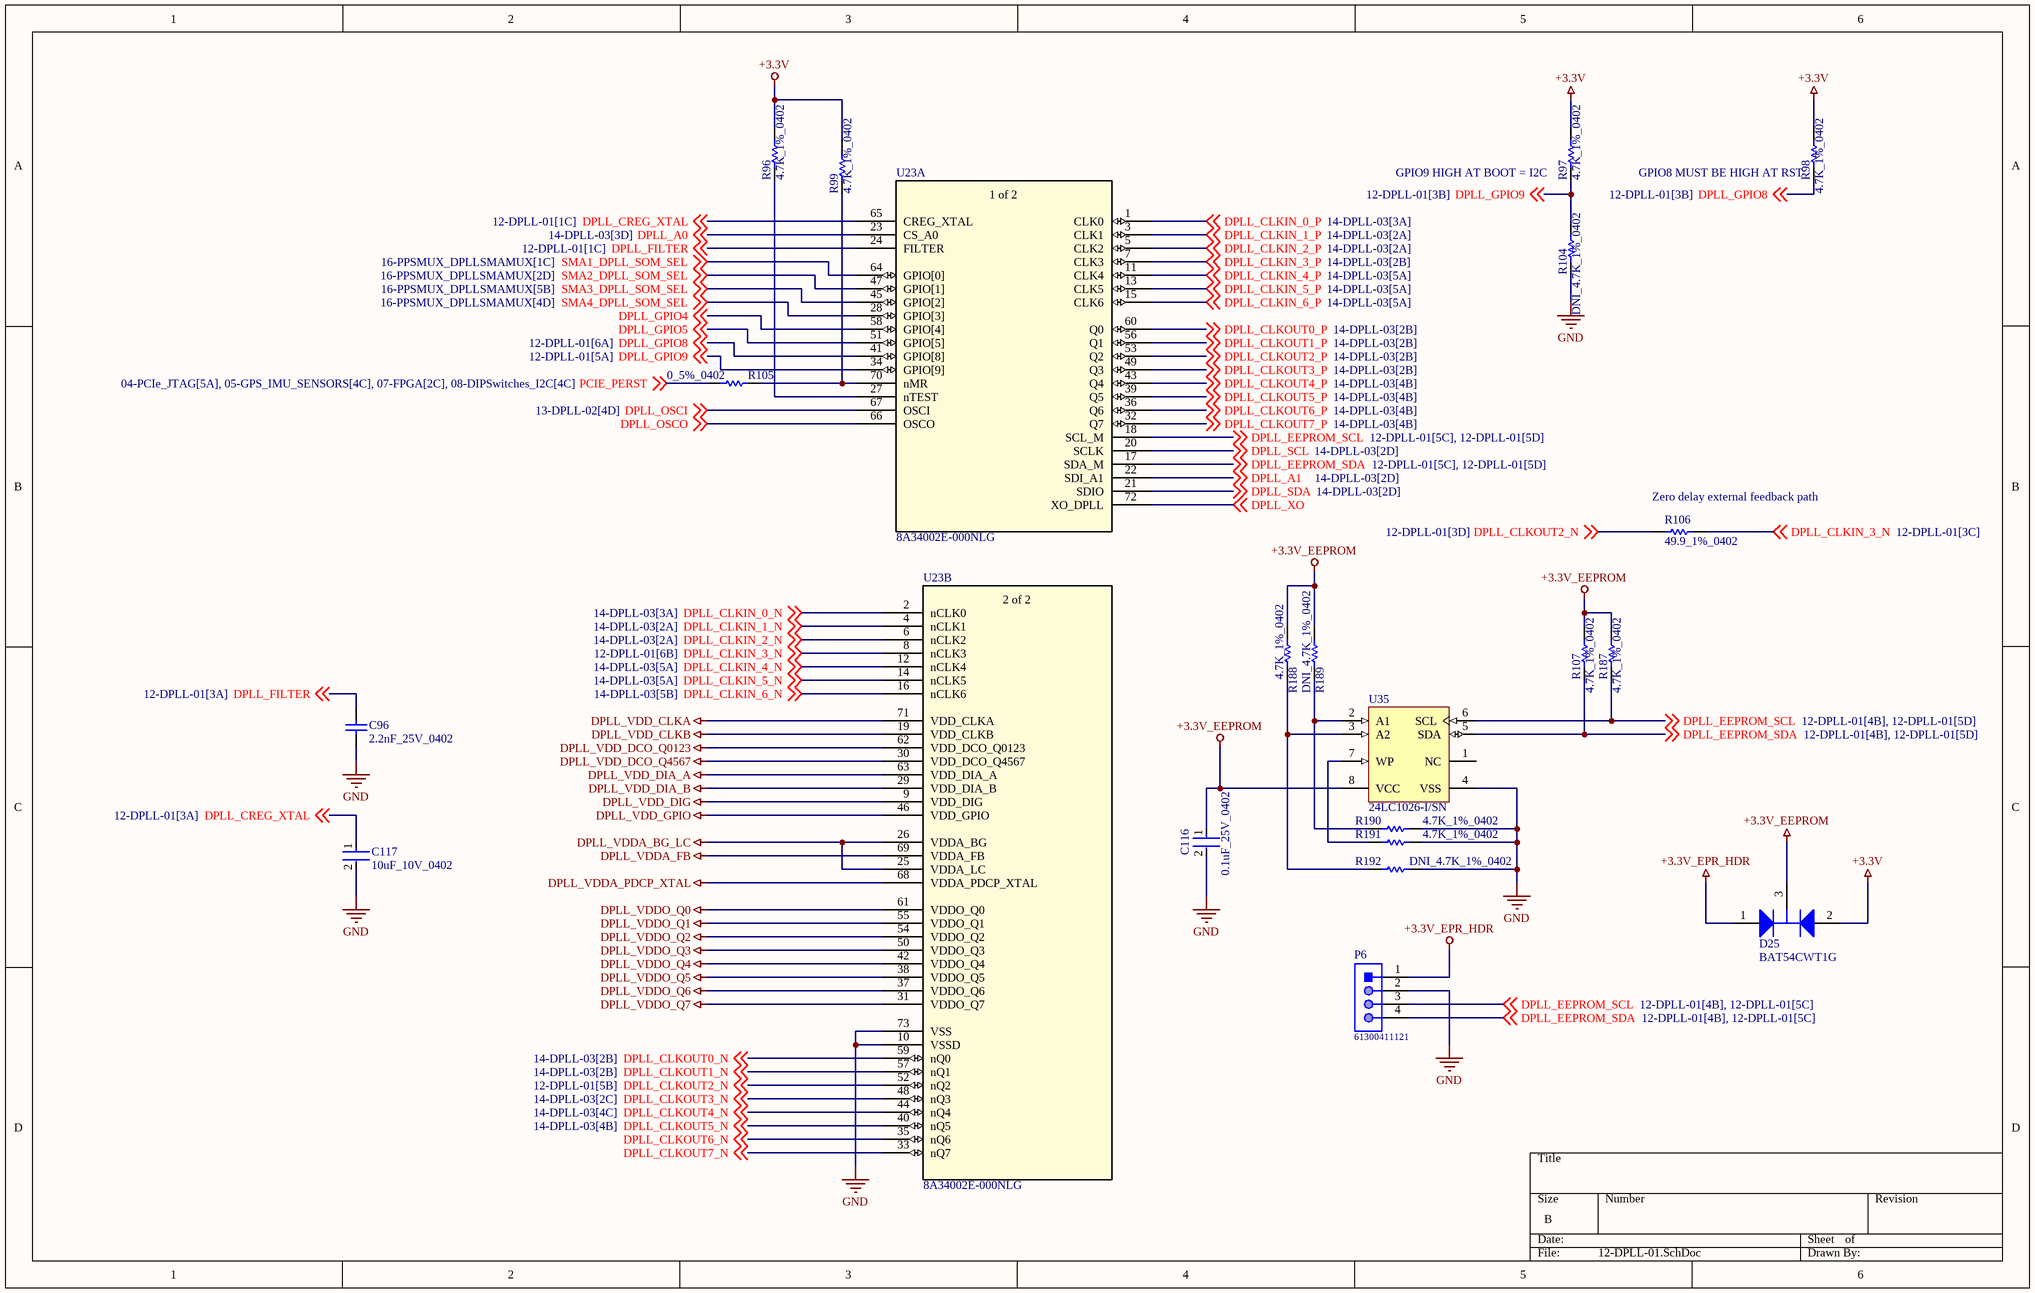
[diagram p11: 12-DPLL-01.SchDoc]

### Parts
C96  2.2nF_25V_0402  [CAPC1005X56X25LL10T15]
C116  0.1uF_25V_0402  [FP-0402-L_1_0_1-W_0_5_0_1-IPC_C]
C117  10uF_10V_0402  [FP-CL05A106MP5NUNC-MFG]
D25  BAT54CWT1G  [ONSC-SOT-323-3-419-04_V]
P6  61300411121  [61300411121]
R96  4.7K_1%_0402  [RESC1005X40X25NL10T10]
R97  4.7K_1%_0402  [RESC1005X40X25NL10T10]
R98  4.7K_1%_0402  [RESC1005X40X25NL10T10]
R99  4.7K_1%_0402  [RESC1005X40X25NL10T10]
R104  DNI_4.7K_1%_0402  [RESC1005X40X25NL10T10]  (no BOM)
R105  0_5%_0402  [RESC1005X40X25LL10T10]
R106  49.9_1%_0402  [RESC1005X40X25NL10T10]
R107  4.7K_1%_0402  [RESC1005X40X25NL10T10]
R187  4.7K_1%_0402  [RESC1005X40X25NL10T10]
R188  4.7K_1%_0402  [RESC1005X40X25NL10T10]
R189  DNI_4.7K_1%_0402  [RESC1005X40X25NL10T10]  (no BOM)
R190  4.7K_1%_0402  [RESC1005X40X25NL10T10]
R191  4.7K_1%_0402  [RESC1005X40X25NL10T10]
R192  DNI_4.7K_1%_0402  [RESC1005X40X25NL10T10]  (no BOM)
U23  8A34002E-000NLG  [QFN_2E-000NLG_REN]  (parts A,B of 2)
U35  24LC1026-I/SN  [MCHP-SOIC-SN8_N]

### Nets
+3.3V: D25.2(A2) R96.2 R97.1 R98.1 R99.2
+3.3V_EEPROM: C116.1 D25.3(K) R107.1 R187.1 R188.2 R189.2 U35.8(VCC)
+3.3V_EPR_HDR: D25.1(A1) P6.1
DPLL_VDD_CLKA: U23.71(VDD_CLKA)
DPLL_VDD_CLKB: U23.19(VDD_CLKB)
DPLL_VDD_DCO_Q0123: U23.62(VDD_DCO_Q0123)
DPLL_VDD_DCO_Q4567: U23.30(VDD_DCO_Q4567)
DPLL_VDD_DIA_A: U23.63(VDD_DIA_A)
DPLL_VDD_DIA_B: U23.29(VDD_DIA_B)
DPLL_VDD_DIG: U23.9(VDD_DIG)
DPLL_VDD_GPIO: U23.46(VDD_GPIO)
DPLL_VDDA_BG_LC: U23.25(VDDA_LC) U23.26(VDDA_BG)
DPLL_VDDA_FB: U23.69(VDDA_FB)
DPLL_VDDA_PDCP_XTAL: U23.68(VDDA_PDCP_XTAL)
DPLL_VDDO_Q0: U23.61(VDDO_Q0)
DPLL_VDDO_Q1: U23.55(VDDO_Q1)
DPLL_VDDO_Q2: U23.54(VDDO_Q2)
DPLL_VDDO_Q3: U23.50(VDDO_Q3)
DPLL_VDDO_Q4: U23.42(VDDO_Q4)
DPLL_VDDO_Q5: U23.38(VDDO_Q5)
DPLL_VDDO_Q6: U23.37(VDDO_Q6)
DPLL_VDDO_Q7: U23.31(VDDO_Q7)
GND: C96.1 C116.2 C117.2 P6.2 R104.2 R190.1 R191.1 R192.2 U23.10(VSSD) U23.73(VSS) U35.4(VSS)
DPLL_A0: U23.23(CS_A0) ; off-sheet DPLL_A0
DPLL_A1: U23.22(SDI_A1) ; off-sheet DPLL_A1
DPLL_CLKIN_0_N: U23.2(nCLK0) ; off-sheet DPLL_CLKIN_0_N
DPLL_CLKIN_0_P: U23.1(CLK0) ; off-sheet DPLL_CLKIN_0_P
DPLL_CLKIN_1_N: U23.4(nCLK1) ; off-sheet DPLL_CLKIN_1_N
DPLL_CLKIN_1_P: U23.3(CLK1) ; off-sheet DPLL_CLKIN_1_P
DPLL_CLKIN_2_N: U23.6(nCLK2) ; off-sheet DPLL_CLKIN_2_N
DPLL_CLKIN_2_P: U23.5(CLK2) ; off-sheet DPLL_CLKIN_2_P
DPLL_CLKIN_3_N: R106.2 U23.8(nCLK3) ; off-sheet DPLL_CLKIN_3_N
DPLL_CLKIN_3_P: U23.7(CLK3) ; off-sheet DPLL_CLKIN_3_P
DPLL_CLKIN_4_N: U23.12(nCLK4) ; off-sheet DPLL_CLKIN_4_N
DPLL_CLKIN_4_P: U23.11(CLK4) ; off-sheet DPLL_CLKIN_4_P
DPLL_CLKIN_5_N: U23.14(nCLK5) ; off-sheet DPLL_CLKIN_5_N
DPLL_CLKIN_5_P: U23.13(CLK5) ; off-sheet DPLL_CLKIN_5_P
DPLL_CLKIN_6_N: U23.16(nCLK6) ; off-sheet DPLL_CLKIN_6_N
DPLL_CLKIN_6_P: U23.15(CLK6) ; off-sheet DPLL_CLKIN_6_P
DPLL_CLKOUT0_N: U23.59(nQ0) ; off-sheet DPLL_CLKOUT0_N
DPLL_CLKOUT0_P: U23.60(Q0) ; off-sheet DPLL_CLKOUT0_P
DPLL_CLKOUT1_N: U23.57(nQ1) ; off-sheet DPLL_CLKOUT1_N
DPLL_CLKOUT1_P: U23.56(Q1) ; off-sheet DPLL_CLKOUT1_P
DPLL_CLKOUT2_N: R106.1 U23.52(nQ2) ; off-sheet DPLL_CLKOUT2_N
DPLL_CLKOUT2_P: U23.53(Q2) ; off-sheet DPLL_CLKOUT2_P
DPLL_CLKOUT3_N: U23.48(nQ3) ; off-sheet DPLL_CLKOUT3_N
DPLL_CLKOUT3_P: U23.49(Q3) ; off-sheet DPLL_CLKOUT3_P
DPLL_CLKOUT4_N: U23.44(nQ4) ; off-sheet DPLL_CLKOUT4_N
DPLL_CLKOUT4_P: U23.43(Q4) ; off-sheet DPLL_CLKOUT4_P
DPLL_CLKOUT5_N: U23.40(nQ5) ; off-sheet DPLL_CLKOUT5_N
DPLL_CLKOUT5_P: U23.39(Q5) ; off-sheet DPLL_CLKOUT5_P
DPLL_CLKOUT6_N: U23.35(nQ6) ; off-sheet DPLL_CLKOUT6_N
DPLL_CLKOUT6_P: U23.36(Q6) ; off-sheet DPLL_CLKOUT6_P
DPLL_CLKOUT7_N: U23.33(nQ7) ; off-sheet DPLL_CLKOUT7_N
DPLL_CLKOUT7_P: U23.32(Q7) ; off-sheet DPLL_CLKOUT7_P
DPLL_CREG_XTAL: C117.1 U23.65(CREG_XTAL) ; off-sheet DPLL_CREG_XTAL
DPLL_EEPROM_SCL: P6.3 R187.2 U23.18(SCL_M) U35.6(SCL) ; off-sheet DPLL_EEPROM_SCL
DPLL_EEPROM_SDA: P6.4 R107.2 U23.17(SDA_M) U35.5(SDA) ; off-sheet DPLL_EEPROM_SDA
DPLL_FILTER: C96.2 U23.24(FILTER) ; off-sheet DPLL_FILTER
DPLL_GPIO4: U23.58(GPIO[4]) ; off-sheet DPLL_GPIO4
DPLL_GPIO5: U23.51(GPIO[5]) ; off-sheet DPLL_GPIO5
DPLL_GPIO8: R98.2 U23.41(GPIO[8]) ; off-sheet DPLL_GPIO8
DPLL_GPIO9: R97.2 R104.1 U23.34(GPIO[9]) ; off-sheet DPLL_GPIO9
DPLL_OSCI: U23.67(OSCI) ; off-sheet DPLL_OSCI
DPLL_OSCO: U23.66(OSCO) ; off-sheet DPLL_OSCO
DPLL_SCL: U23.20(SCLK) ; off-sheet DPLL_SCL
DPLL_SDA: U23.21(SDIO) ; off-sheet DPLL_SDA
DPLL_XO: U23.72(XO_DPLL) ; off-sheet DPLL_XO
PCIE_PERST: R105.1 ; off-sheet PCIE_PERST
SMA1_DPLL_SOM_SEL: U23.64(GPIO[0]) ; off-sheet SMA1_DPLL_SOM_SEL
SMA2_DPLL_SOM_SEL: U23.47(GPIO[1]) ; off-sheet SMA2_DPLL_SOM_SEL
SMA3_DPLL_SOM_SEL: U23.45(GPIO[2]) ; off-sheet SMA3_DPLL_SOM_SEL
SMA4_DPLL_SOM_SEL: U23.28(GPIO[3]) ; off-sheet SMA4_DPLL_SOM_SEL
NetR96_1: R96.1 U23.27(nTEST)
NetR99_1: R99.1 R105.2 U23.70(nMR)
NetR188_1: R188.1 R192.1 U35.3(A2)
NetR189_1: R189.1 R190.2 U35.2(A1)
NetR191_2: R191.2 U35.7(WP)

Not connected (* = marked no-connect by the designer): U35 1(NC)

### Notes on the sheet
- (near R97) GPIO9 HIGH AT BOOT = I2C
- (near R98) GPIO8 MUST BE HIGH AT RST
- (near R106) Zero delay external feedback path
- (in symbol 8A34002E-000NLG, part A) 1 of 2
- (in symbol 8A34002E-000NLG, part B) 2 of 2

### Library data of the parts
C96 = CMP-2008-02907-1: Manufacturer: AVX Interconnect / Elco; Part Number: 04025C222JAT2A
C116 = CMP-2008-02519-2: as C89 on sheet 09-USBUart_PPSMUX_UARTMUX; Package Quantity: 1; Capacitance: 100nF; Min Operating Temperature: -55°C; Voltage: 25V; Voltage Rating: 25V; Construction: Flat; Max Operating Temperature: 125°C; Radiation Hardening: No; Depth: 0.5mm; Thickness: 0.022inch; Voltage Rating (DC): 25V; Number of Pins: 2; Lead Free: Lead Free; Series: -; REACH SVHC: No SVHC; Length: 1mm; Dielectric: X7R; RoHS Compliant: Yes; Mount: Surface Mount; Packaging: Tape and Reel; Case/Package: 0402; Case Code (Imperial): 0402; Termination: SMD/SMT; Width: 0.02inch; Case Code (Metric): 1005; Tolerance: 10%
C117 = CMP-13271-000002-1: CAP CER 10UF 10V X5R 0402; Manufacturer Part Number: CL05A106MP5NUNC; Manufacturer: Samsung; Temperature Coefficient: 15%; Tolerance: 20%; Material: Ceramic; Octopart: https://octopart.com/cl05a106mp5nunc-samsung-22457395; Voltage Rating: 10V; RoHS: TRUE; Value: 10uF; Height: 0.7mm; Digikey Description: CAP CER 10UF 10V X5R 0402; Automotive: No; Package: CL05A106MP5NUNC; Device Class L1: Passive Components; Capacitance: 10uF; Temperature Range High: +85°C; ComponentLink2Description: Datasheet; Device Class L2: Capacitors; Temperature Characteristic: X5R; Temperature: -55°C to +85°C; ComponentLink2URL: http://www.samsungsem.com/kr/support/product-search/mlcc/__icsFiles/afieldfile/2019/05/10/19-CL05A106MP5NUNC.pdf; Device Class L3: Ceramic Capacitors; Category: Cap; Temperature Range Low: -55°C; Ipc Land Pattern Name: CAPC10050X50; Lead Free: Yes
D25 = CMP-1055-00557-1: Dual Series Cathode Schottky Barrier Diodes, 3-Pin SOT-323, Pb-Free, Tape and Reel; Manufacturer: On Semiconductor; Configuration: Common Cathode; IFSM Max (A): 0.6; trr Max (ns): 5; ComponentLink2Description: Datasheet; Packing: Tape and Reel; ComponentLink3Description: Package Specification; Mounting Technology: Surface Mount; PartNumber: BAT54CWT1G; PackageVersion: Rev. N, 11/2008; RoHS: TRUE; ComponentLink3URL: http://www.onsemi.com/pub_link/Collateral/419-04.PDF; ComponentLink2URL: http://www.onsemi.cn/pub_link/Collateral/BAT54CWT1-D.PDF; PackageReference: SOT-323-3-419-04; ComponentLink1URL: http://www.onsemi.com/; ComponentLink1Description: Manufacturer URL; DatasheetVersion: Rev. 7; PackageDescription: 3-Pin Small Outline Transistor, Body 2 x 1.25 mm, Pitch 0.65 mm
P6 = CMP-1502-01064-1: THT Vertical Pin Header WR-PHD, Pitch 2.54 mm, Single Row, 4 pins; Manufacturer: Wurth Elektronik; Withstanding Voltage: 500VAC; Rated Current: 3A; Working Voltage: 250VAC; Pin Number: 4; Gender: Male; Contact Resistance: 20mOhm; Pitch: 2.54mm; Manufacturer URL: http://www.we-online.de; Operating Temperature: -40to105degC; Packaging: Bag; Mounting Technology: THT; Package Reference: 61300411121; Datasheet URL: https://katalog.we-online.de/em/datasheet/6130xx11121.pdf; Publisher: WurthElektronik; Part Number: 61300411121; Row Number: Single; Orientation: Vertical
R96-R99 R104 R107 R187-R192 = CMP-2002-05217-1: as R113-R120 on sheet 08-DIPSwitches_I2C
R105 = CMP-2002-04569-1: Manufacturer: KOA Speer; Part Number: RK73Z1ETTP
R106 = CMP-2002-04448-1: Part Number: RK73H1ETTP49R9F; Manufacturer: KOA Speer
U23 = 8A34002E-000NLG: No Description Available; Mfr_Name: Renesas Electronics; RefDes: RefDes; Type: Type
U35 = CMP-0159-01024-1: 1024K bits I2C™ Serial EEPROM, 2.5 to 5.5 V, 400 kHz, -40 to 85 degC, 8-pin SOIC (SN8), Tube; Manufacturer: Microchip; DatasheetVersion: Rev. C; ComponentLink3Description: Package Specification; ComponentLink1URL: http://www.microchip.com; Mounting Technology: Surface Mount; ComponentLink4URL: http://www.microchip.com/24LC1026; ComponentLink2Description: Datasheet; PartNumber: 24LC1026-I/SN; PackageReference: SOIC-SN8; PackageDescription: 8-Lead Plastic Small Outline, 4.9 x 3.9 mm Body, 1.27 mm Pitch; ComponentLink1Description: Manufacturer URL; ComponentLink3URL: http://www.microchip.com/stellent/groups/techpub_sg/documents/packagingspec/en012702.pdf; ComponentLink2URL: http://ww1.microchip.com/downloads/en/DeviceDoc/22270C.pdf; PackageVersion: C04-057C; ComponentLink4Description: Product URL

## Sheet 15-100M_ClkBuffer.SchDoc
size B; SheetNumber: 15; SheetTotal: 16
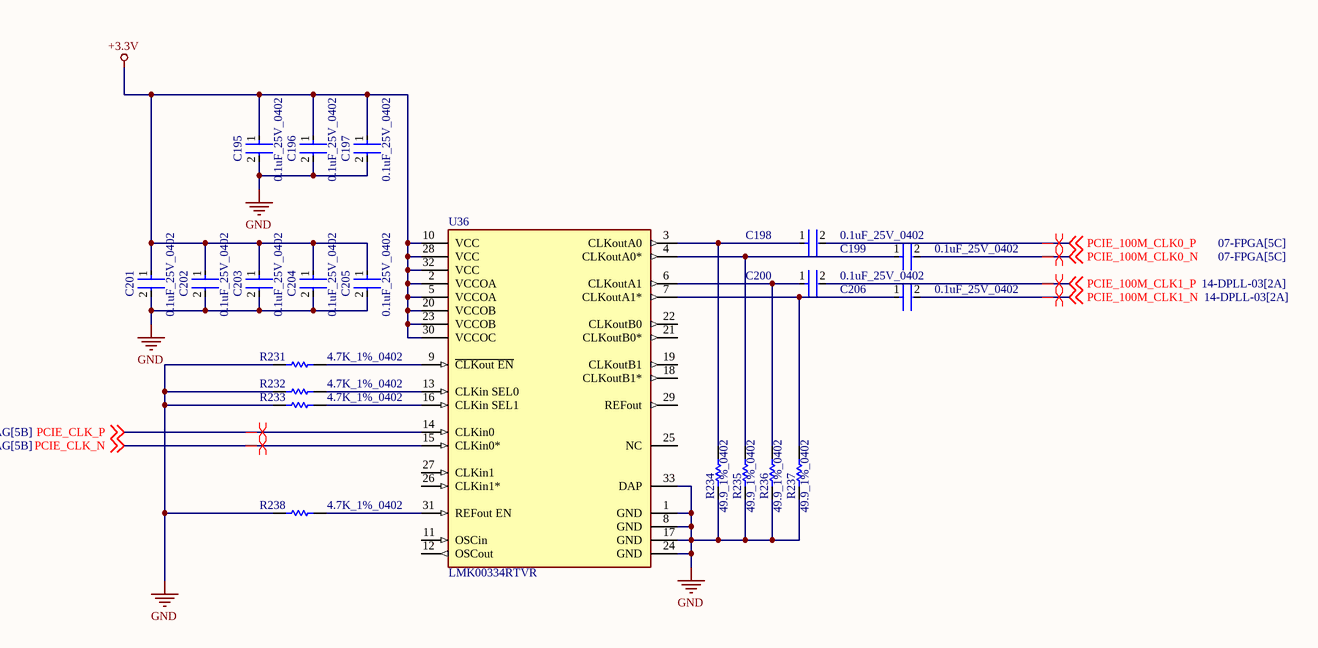
[diagram p12: 15-100M_ClkBuffer.SchDoc]

### Parts
C195  0.1uF_25V_0402  [FP-0402-L_1_0_1-W_0_5_0_1-IPC_C]
C196  0.1uF_25V_0402  [FP-0402-L_1_0_1-W_0_5_0_1-IPC_C]
C197  0.1uF_25V_0402  [FP-0402-L_1_0_1-W_0_5_0_1-IPC_C]
C198  0.1uF_25V_0402  [FP-0402-L_1_0_1-W_0_5_0_1-IPC_C]
C199  0.1uF_25V_0402  [FP-0402-L_1_0_1-W_0_5_0_1-IPC_C]
C200  0.1uF_25V_0402  [FP-0402-L_1_0_1-W_0_5_0_1-IPC_C]
C201  0.1uF_25V_0402  [FP-0402-L_1_0_1-W_0_5_0_1-IPC_C]
C202  0.1uF_25V_0402  [FP-0402-L_1_0_1-W_0_5_0_1-IPC_C]
C203  0.1uF_25V_0402  [FP-0402-L_1_0_1-W_0_5_0_1-IPC_C]
C204  0.1uF_25V_0402  [FP-0402-L_1_0_1-W_0_5_0_1-IPC_C]
C205  0.1uF_25V_0402  [FP-0402-L_1_0_1-W_0_5_0_1-IPC_C]
C206  0.1uF_25V_0402  [FP-0402-L_1_0_1-W_0_5_0_1-IPC_C]
R231  4.7K_1%_0402  [RESC1005X40X25NL10T10]
R232  4.7K_1%_0402  [RESC1005X40X25NL10T10]
R233  4.7K_1%_0402  [RESC1005X40X25NL10T10]
R234  49.9_1%_0402  [RESC1005X40X25NL10T10]
R235  49.9_1%_0402  [RESC1005X40X25NL10T10]
R236  49.9_1%_0402  [RESC1005X40X25NL10T10]
R237  49.9_1%_0402  [RESC1005X40X25NL10T10]
R238  4.7K_1%_0402  [RESC1005X40X25NL10T10]
U36  LMK00334RTVR  [FP-RTV0032A-MFG]

### Nets
+3.3V: C195.1 C196.1 C197.1 C201.1 C202.1 C203.1 C204.1 C205.1 U36.2(VCCOA) U36.5(VCCOA) U36.10(VCC) U36.20(VCCOB) U36.23(VCCOB) U36.28(VCC) U36.30(VCCOC) U36.32(VCC)
GND: C195.2 C196.2 C197.2 C201.2 C202.2 C203.2 C204.2 C205.2 R231.2 R232.2 R233.2 R234.1 R235.1 R236.1 R237.1 R238.2 U36.1(GND) U36.8(GND) U36.17(GND) U36.24(GND) U36.33(DAP)
PCIE_100M_CLK0_N: C199.2 ; off-sheet PCIE_100M_CLK0_N
PCIE_100M_CLK0_P: C198.2 ; off-sheet PCIE_100M_CLK0_P
PCIE_100M_CLK1_N: C206.2 ; off-sheet PCIE_100M_CLK1_N
PCIE_100M_CLK1_P: C200.2 ; off-sheet PCIE_100M_CLK1_P
PCIE_CLK_N: U36.15(CLKin0*) ; off-sheet PCIE_CLK_N
PCIE_CLK_P: U36.14(CLKin0) ; off-sheet PCIE_CLK_P
NetC198_1: C198.1 R234.2 U36.3(CLKoutA0)
NetC199_1: C199.1 R235.2 U36.4(CLKoutA0*)
NetC200_1: C200.1 R236.2 U36.6(CLKoutA1)
NetC206_1: C206.1 R237.2 U36.7(CLKoutA1*)
NetR231_1: R231.1 U36.9(~{CLKout_EN})
NetR232_1: R232.1 U36.13(CLKin_SEL0)
NetR233_1: R233.1 U36.16(CLKin_SEL1)
NetR238_1: R238.1 U36.31(REFout_EN)

Not connected (* = marked no-connect by the designer): U36 11(OSCin) 12(OSCout) 18(CLKoutB1*) 19(CLKoutB1) 21(CLKoutB0*) 22(CLKoutB0) 25(NC) 26(CLKin1*) 27(CLKin1) 29(REFout)

### Layout directives
differential pair: PCIE_100M_CLK0_N, PCIE_100M_CLK0_P, PCIE_100M_CLK1_N, PCIE_100M_CLK1_P, PCIE_CLK_N, PCIE_CLK_P

### Library data of the parts
C195-C206 = CMP-2008-02519-2: as C89 on sheet 09-USBUart_PPSMUX_UARTMUX; Package Quantity: 1; Capacitance: 100nF; Min Operating Temperature: -55°C; Voltage: 25V; Voltage Rating: 25V; Construction: Flat; Max Operating Temperature: 125°C; Radiation Hardening: No; Depth: 0.5mm; Thickness: 0.022inch; Voltage Rating (DC): 25V; Number of Pins: 2; Lead Free: Lead Free; Series: -; REACH SVHC: No SVHC; Length: 1mm; Dielectric: X7R; RoHS Compliant: Yes; Mount: Surface Mount; Packaging: Tape and Reel; Case/Package: 0402; Case Code (Imperial): 0402; Termination: SMD/SMT; Width: 0.02inch; Case Code (Metric): 1005; Tolerance: 10%
R231-R233 R238 = CMP-2002-05217-1: as R113-R120 on sheet 08-DIPSwitches_I2C
R234-R237 = CMP-2002-04448-1: as R106 on sheet 12-DPLL-01
U36 = CMP-04855-000011-1: IC CLK BUF 400MHZ 1CIRC 32WQFN; Number of Outputs: 4; Max Supply Voltage: 3.45V; PLL: No; Max Duty Cycle: 55%; Operating Supply Current: 13.5mA; Min Supply Voltage: 3.15V; Nominal Supply Current: 8.5mA; Input: Crystal; Propagation Delay: 2700ps; Operating Supply Voltage: 3.3V; Number of Circuits: 1; REACH SVHC: No SVHC; Radiation Hardening: No; RoHS Compliant: Yes; Lead Free: Lead Free; Mount: Surface Mount; Min Operating Temperature: -40°C; Package Quantity: 1000; Max Operating Temperature: 85°C; Number of Pins: 32; Max Frequency: 400MHz; Frequency: 400MHz; Packaging: Tape and Reel

## Sheet 16-PPSMUX_DPLLSMAMUX.SchDoc
size B; SheetNumber: 16; SheetTotal: 16
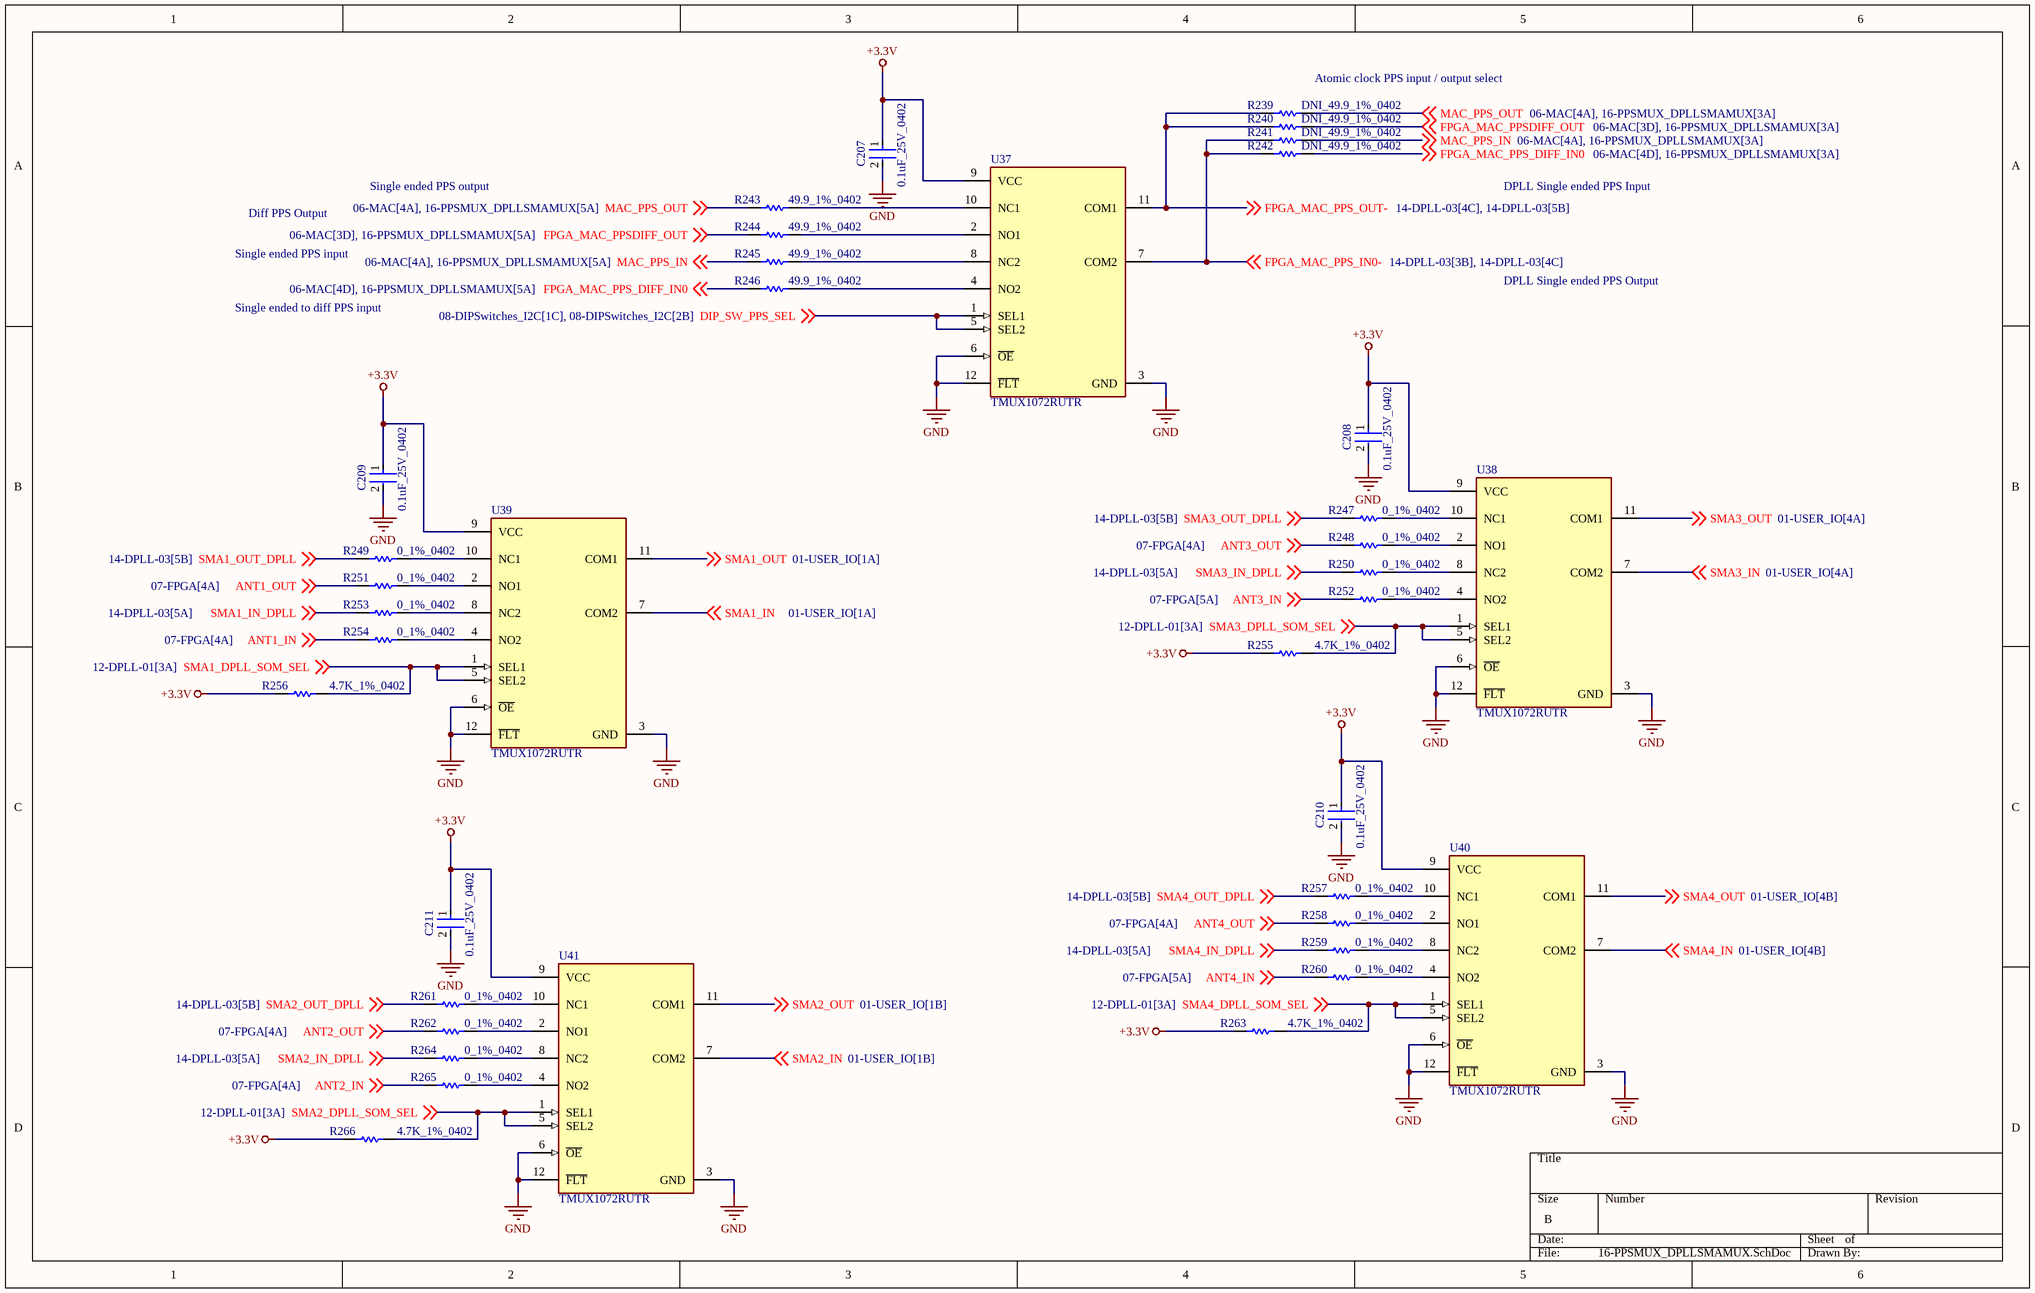
[diagram p13: 16-PPSMUX_DPLLSMAMUX.SchDoc]

### Parts
C207  0.1uF_25V_0402  [FP-0402-L_1_0_1-W_0_5_0_1-IPC_C]
C208  0.1uF_25V_0402  [FP-0402-L_1_0_1-W_0_5_0_1-IPC_C]
C209  0.1uF_25V_0402  [FP-0402-L_1_0_1-W_0_5_0_1-IPC_C]
C210  0.1uF_25V_0402  [FP-0402-L_1_0_1-W_0_5_0_1-IPC_C]
C211  0.1uF_25V_0402  [FP-0402-L_1_0_1-W_0_5_0_1-IPC_C]
R239  DNI_49.9_1%_0402  [RESC1005X40X25LL05T10]  (no BOM)
R240  DNI_49.9_1%_0402  [RESC1005X40X25LL05T10]  (no BOM)
R241  DNI_49.9_1%_0402  [RESC1005X40X25LL05T10]  (no BOM)
R242  DNI_49.9_1%_0402  [RESC1005X40X25LL05T10]  (no BOM)
R243  49.9_1%_0402  [RESC1005X40X25LL05T10]
R244  49.9_1%_0402  [RESC1005X40X25LL05T10]
R245  49.9_1%_0402  [RESC1005X40X25LL05T10]
R246  49.9_1%_0402  [RESC1005X40X25LL05T10]
R247  0_1%_0402  [RESC1005X40X25LL05T05]
R248  0_1%_0402  [RESC1005X40X25LL05T05]
R249  0_1%_0402  [RESC1005X40X25LL05T05]
R250  0_1%_0402  [RESC1005X40X25LL05T05]
R251  0_1%_0402  [RESC1005X40X25LL05T05]
R252  0_1%_0402  [RESC1005X40X25LL05T05]
R253  0_1%_0402  [RESC1005X40X25LL05T05]
R254  0_1%_0402  [RESC1005X40X25LL05T05]
R255  4.7K_1%_0402  [RESC1005X40X25NL10T10]
R256  4.7K_1%_0402  [RESC1005X40X25NL10T10]
R257  0_1%_0402  [RESC1005X40X25LL05T05]
R258  0_1%_0402  [RESC1005X40X25LL05T05]
R259  0_1%_0402  [RESC1005X40X25LL05T05]
R260  0_1%_0402  [RESC1005X40X25LL05T05]
R261  0_1%_0402  [RESC1005X40X25LL05T05]
R262  0_1%_0402  [RESC1005X40X25LL05T05]
R263  4.7K_1%_0402  [RESC1005X40X25NL10T10]
R264  0_1%_0402  [RESC1005X40X25LL05T05]
R265  0_1%_0402  [RESC1005X40X25LL05T05]
R266  4.7K_1%_0402  [RESC1005X40X25NL10T10]
U37  TMUX1072RUTR  [FP-RUT0012A-MFG]
U38  TMUX1072RUTR  [FP-RUT0012A-MFG]
U39  TMUX1072RUTR  [FP-RUT0012A-MFG]
U40  TMUX1072RUTR  [FP-RUT0012A-MFG]
U41  TMUX1072RUTR  [FP-RUT0012A-MFG]

### Nets
+3.3V: C207.1 C208.1 C209.1 C210.1 C211.1 R255.2 R256.2 R263.2 R266.2 U37.9(VCC) U38.9(VCC) U39.9(VCC) U40.9(VCC) U41.9(VCC)
GND: C207.2 C208.2 C209.2 C210.2 C211.2 U37.3(GND) U37.6(~{OE}) U37.12(~{FLT}) U38.3(GND) U38.6(~{OE}) U38.12(~{FLT}) U39.3(GND) U39.6(~{OE}) U39.12(~{FLT}) U40.3(GND) U40.6(~{OE}) U40.12(~{FLT}) U41.3(GND) U41.6(~{OE}) U41.12(~{FLT})
ANT1_IN: R254.1 ; off-sheet ANT1_IN
ANT1_OUT: R251.1 ; off-sheet ANT1_OUT
ANT2_IN: R265.1 ; off-sheet ANT2_IN
ANT2_OUT: R262.1 ; off-sheet ANT2_OUT
ANT3_IN: R252.1 ; off-sheet ANT3_IN
ANT3_OUT: R248.1 ; off-sheet ANT3_OUT
ANT4_IN: R260.1 ; off-sheet ANT4_IN
ANT4_OUT: R258.1 ; off-sheet ANT4_OUT
DIP_SW_PPS_SEL: U37.1(SEL1) U37.5(SEL2) ; off-sheet DIP_SW_PPS_SEL
FPGA_MAC_PPS_DIFF_IN0: R242.2 R246.1 ; off-sheet FPGA_MAC_PPS_DIFF_IN0
FPGA_MAC_PPS_IN0-: R241.1 R242.1 U37.7(COM2) ; off-sheet FPGA_MAC_PPS_IN0-
FPGA_MAC_PPS_OUT-: R239.1 R240.1 U37.11(COM1) ; off-sheet FPGA_MAC_PPS_OUT-
FPGA_MAC_PPSDIFF_OUT: R240.2 R244.1 ; off-sheet FPGA_MAC_PPSDIFF_OUT
MAC_PPS_IN: R241.2 R245.1 ; off-sheet MAC_PPS_IN
MAC_PPS_OUT: R239.2 R243.1 ; off-sheet MAC_PPS_OUT
SMA1_DPLL_SOM_SEL: R256.1 U39.1(SEL1) U39.5(SEL2) ; off-sheet SMA1_DPLL_SOM_SEL
SMA1_IN: U39.7(COM2) ; off-sheet SMA1_IN
SMA1_IN_DPLL: R253.1 ; off-sheet SMA1_IN_DPLL
SMA1_OUT: U39.11(COM1) ; off-sheet SMA1_OUT
SMA1_OUT_DPLL: R249.1 ; off-sheet SMA1_OUT_DPLL
SMA2_DPLL_SOM_SEL: R266.1 U41.1(SEL1) U41.5(SEL2) ; off-sheet SMA2_DPLL_SOM_SEL
SMA2_IN: U41.7(COM2) ; off-sheet SMA2_IN
SMA2_IN_DPLL: R264.1 ; off-sheet SMA2_IN_DPLL
SMA2_OUT: U41.11(COM1) ; off-sheet SMA2_OUT
SMA2_OUT_DPLL: R261.1 ; off-sheet SMA2_OUT_DPLL
SMA3_DPLL_SOM_SEL: R255.1 U38.1(SEL1) U38.5(SEL2) ; off-sheet SMA3_DPLL_SOM_SEL
SMA3_IN: U38.7(COM2) ; off-sheet SMA3_IN
SMA3_IN_DPLL: R250.1 ; off-sheet SMA3_IN_DPLL
SMA3_OUT: U38.11(COM1) ; off-sheet SMA3_OUT
SMA3_OUT_DPLL: R247.1 ; off-sheet SMA3_OUT_DPLL
SMA4_DPLL_SOM_SEL: R263.1 U40.1(SEL1) U40.5(SEL2) ; off-sheet SMA4_DPLL_SOM_SEL
SMA4_IN: U40.7(COM2) ; off-sheet SMA4_IN
SMA4_IN_DPLL: R259.1 ; off-sheet SMA4_IN_DPLL
SMA4_OUT: U40.11(COM1) ; off-sheet SMA4_OUT
SMA4_OUT_DPLL: R257.1 ; off-sheet SMA4_OUT_DPLL
NetR243_2: R243.2 U37.10(NC1)
NetR244_2: R244.2 U37.2(NO1)
NetR245_2: R245.2 U37.8(NC2)
NetR246_2: R246.2 U37.4(NO2)
NetR247_2: R247.2 U38.10(NC1)
NetR248_2: R248.2 U38.2(NO1)
NetR249_2: R249.2 U39.10(NC1)
NetR250_2: R250.2 U38.8(NC2)
NetR251_2: R251.2 U39.2(NO1)
NetR252_2: R252.2 U38.4(NO2)
NetR253_2: R253.2 U39.8(NC2)
NetR254_2: R254.2 U39.4(NO2)
NetR257_2: R257.2 U40.10(NC1)
NetR258_2: R258.2 U40.2(NO1)
NetR259_2: R259.2 U40.8(NC2)
NetR260_2: R260.2 U40.4(NO2)
NetR261_2: R261.2 U41.10(NC1)
NetR262_2: R262.2 U41.2(NO1)
NetR264_2: R264.2 U41.8(NC2)
NetR265_2: R265.2 U41.4(NO2)

### Notes on the sheet
- Atomic clock PPS input / output select
- Diff PPS Output
- Single ended PPS output
- DPLL Single ended PPS Input
- Single ended PPS input
- DPLL Single ended PPS Output
- Single ended to diff PPS input

### Library data of the parts
C207-C211 = CMP-2008-02519-2: as C89 on sheet 09-USBUart_PPSMUX_UARTMUX; Package Quantity: 1; Capacitance: 100nF; Min Operating Temperature: -55°C; Voltage: 25V; Voltage Rating: 25V; Construction: Flat; Max Operating Temperature: 125°C; Radiation Hardening: No; Depth: 0.5mm; Thickness: 0.022inch; Voltage Rating (DC): 25V; Number of Pins: 2; Lead Free: Lead Free; Series: -; REACH SVHC: No SVHC; Length: 1mm; Dielectric: X7R; RoHS Compliant: Yes; Mount: Surface Mount; Packaging: Tape and Reel; Case/Package: 0402; Case Code (Imperial): 0402; Termination: SMD/SMT; Width: 0.02inch; Case Code (Metric): 1005; Tolerance: 10%
R239-R246 = CMP-2002-07709-1: as R142 on sheet 11-M2_RCB_MUX
R247-R254 R257-R262 R264 R265 = CMP-2000-07451-1: Chip Resistor, 0 Ohm, 0.1 W, -55 to 155 degC, 0402 (1005 Metric), RoHS, Tape and Reel; Manufacturer: Panasonic; Voltage Rating (DC): 50V; Temperature Coefficient: 600ppm/��C; Max Power Dissipation: 100mW; Resistance: 0mOhm; Tolerance: 5%; Number of Terminations: 2; Mount: SurfaceMount; Height: 0.35mm; Packaging: TapeandReel; Contact Plating: Tin; Manufacturer URL: http://www.panasonic.com/; Composition: ThickFilm; Max Operating Temperature: 155degC; REACH SVHC: NoSVHC; Case/Package: 0402; Package Reference: 402; Depth: 0.5mm; Package Description: 2-Pin Surface Mount Device, Body 1 x 0.5 mm; Datasheet URL: https://industrial.panasonic.com/cdbs/www-data/pdf/RDA0000/AOA0000C301.pdf; RoHSCompliant: True; Case Code (Imperial): 0402; Military Standard: Not; Min Operating Temperature: -55degC; Power Rating: 100mW; Datasheet Version: 03/2015; Length: 1mm; Case Code (Metric): 1005; Termination: SMD/SMT; Mounting Technology: SurfaceMount; Voltage Rating: 50V; Width: 0.02inch; Package Quantity: 1; Lead Free: LeadFree; Radiation Hardening: No
R255 R256 R263 R266 = CMP-2002-05217-1: as R113-R120 on sheet 08-DIPSwitches_I2C
U37-U41 = CMP-04892-000114-1: as U21 on sheet 09-USBUart_PPSMUX_UARTMUX; Number of Pins: 12; Min Operating Temperature: -40°C; RoHS Compliant: Yes; Max Operating Temperature: 125°C; Number of Channels: 2; Packaging: Tape and Reel